# Altium project Mind Cloud Final Project.PrjPcb
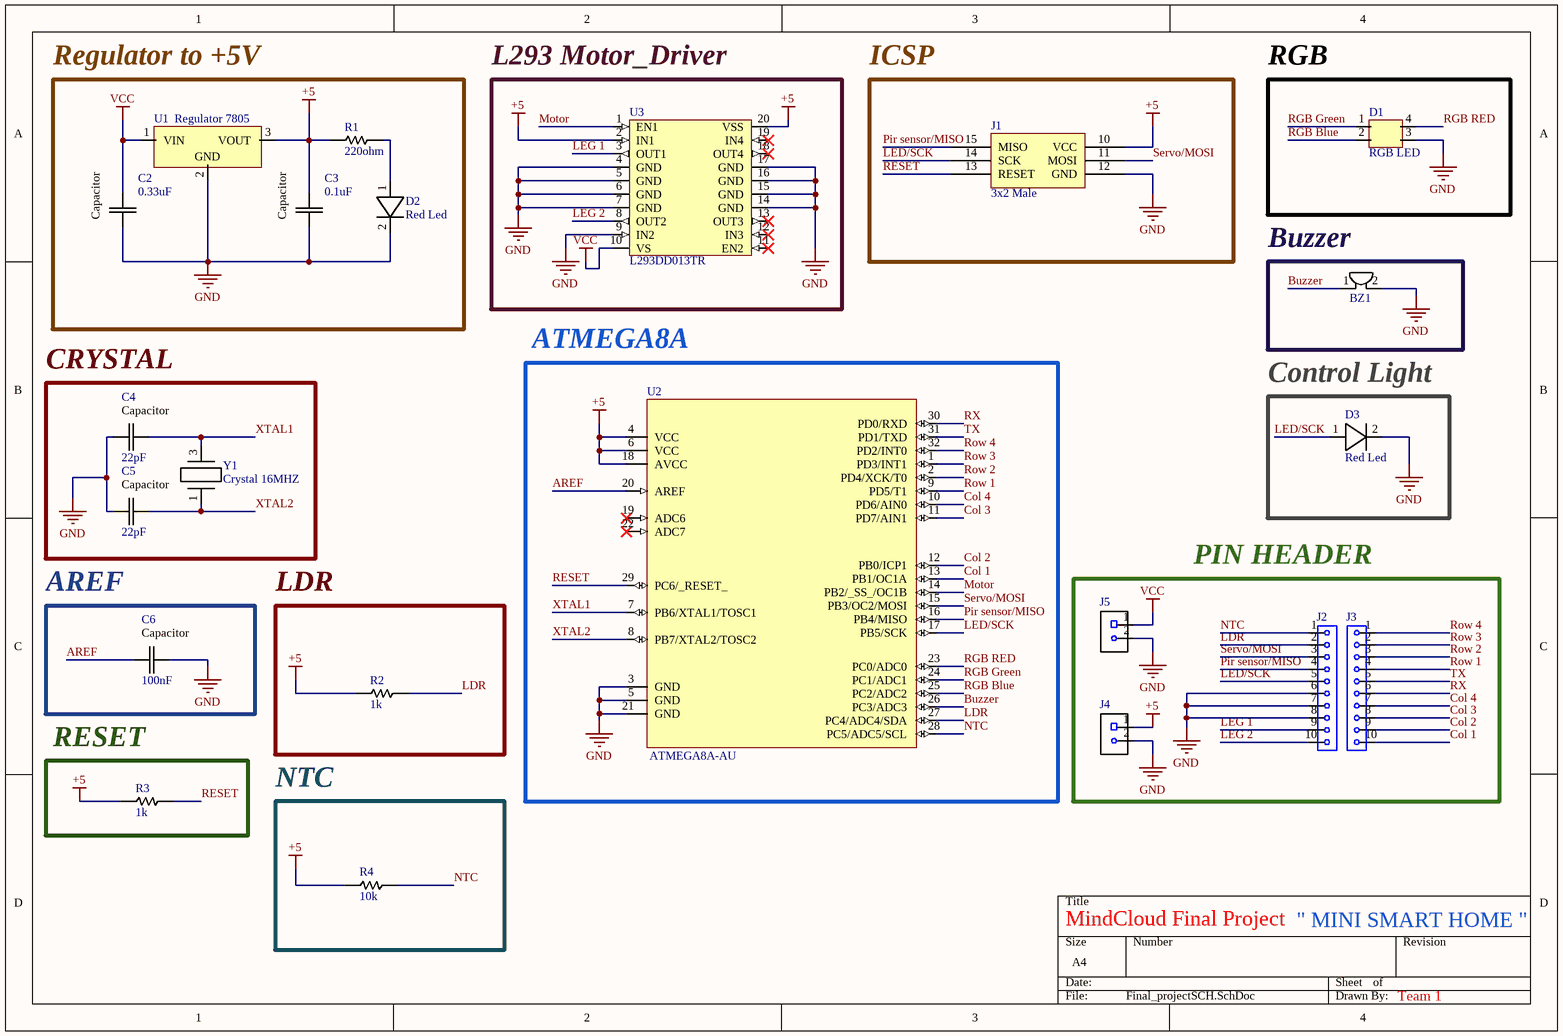
[diagram p0: Final_projectSCH.SchDoc]
Date: 6/9/2024; Team: 1
1 sheet, 22 parts. Net scope: global (net labels, ports and power ports of the same name join across sheets).
Board file: Final_projectPCB.PcbDoc

## Sheet Final_projectSCH.SchDoc
size A4; SheetNumber: 1; SheetTotal: 1

### Parts
BZ1  Buzzer  [Buzzer]  (value not drawn)
C2  0.33uF  [Capacitor SMD]
C3  0.1uF  [Capacitor SMD]
C4  22pF  [Capacitor SMD]
C5  22pF  [Capacitor SMD]
C6  100nF  [Capacitor SMD]
D1  RGB LED  [RGB LED]
D2  Red Led  [Red LED]
D3  Red Led  [Red LED]
J1  3x2 Male  [3x2 Male]
J2  (no value)  [Female Pinheader10]
J3  (no value)  [Female Pinheader10]
J4  Screw Terminal 2 pins  [Screw Terminal 2 pins]  (value not drawn)
J5  Screw Terminal 2 pins  [Screw Terminal 2 pins]  (value not drawn)
R1  220ohm  [R0805]
R2  1k  [R0805]
R3  1k  [R0805]
R4  10k  [R0805]
U1  Regulator 7805  [Regulator 7805]
U2  ATMEGA8A-AU  [ATMEGA8A-AU]
U3  L293DD013TR  [L293DD013TR]
Y1  Crystal 16MHZ  [Crystal 16MHZ]

### Blocks framed on the sheet
Regulator to +5V: C2 C3 D2 R1 U1
L293 Motor_Driver: U3
ICSP: J1
RGB: D1
Buzzer: BZ1
CRYSTAL: C4 C5 Y1
ATMEGA8A: U2
Control Light: D3
AREF: C6
LDR: R2
PIN HEADER: J2-J5
RESET: R3
NTC: R4

### Nets
+5: C3.2 J1.10(VCC) J4.1 R1.2 R2.2 R3.2 R4.2 U1.3(VOUT) U2.4(VCC) U2.6(VCC) U2.18(AVCC) U3.2(IN1) U3.20(VSS)
GND: BZ1.2(-) C2.1 C3.1 C4.1 C5.1 C6.2 D1.3(GND) D2.2(-ve) D3.2(-ve) J1.12(GND) J2.6 J2.7 J2.8 J4.2 J5.2 U1.2(GND) U2.3(GND) U2.5(GND) U2.21(GND) U3.4(GND) U3.5(GND) U3.6(GND) U3.7(GND) U3.9(IN2) U3.14(GND) U3.15(GND) U3.16(GND) U3.17(GND)
VCC: C2.2 J5.1 U1.1(VIN) U3.10(VS)
AREF: C6.1 U2.20(AREF)
Buzzer: BZ1.1(+) U2.26(PC3/ADC3)
Col 1: J3.10 U2.13(PB1/OC1A)
Col 2: J3.9 U2.12(PB0/ICP1)
Col 3: J3.8 U2.11(PD7/AIN1)
Col 4: J3.7 U2.10(PD6/AIN0)
LDR: J2.2 R2.1 U2.27(PC4/ADC4/SDA)
LED/SCK: D3.1(+ve) J1.14(SCK) J2.5 U2.17(PB5/SCK)
LEG 1: J2.9 U3.3(OUT1)
LEG 2: J2.10 U3.8(OUT2)
Motor: U2.14(PB2/_SS_/OC1B) U3.1(EN1)
NTC: J2.1 R4.1 U2.28(PC5/ADC5/SCL)
Pir sensor/MISO: J1.15(MISO) J2.4 U2.16(PB4/MISO)
RESET: J1.13(RESET) R3.1 U2.29(PC6/_RESET_)
RGB Blue: D1.2(DOUT) U2.25(PC2/ADC2)
RGB Green: D1.1(VSS) U2.24(PC1/ADC1)
RGB RED: D1.4(DIN) U2.23(PC0/ADC0)
Row 1: J3.4 U2.9(PD5/T1)
Row 2: J3.3 U2.2(PD4/XCK/T0)
Row 3: J3.2 U2.1(PD3/INT1)
Row 4: J3.1 U2.32(PD2/INT0)
RX: J3.6 U2.30(PD0/RXD)
Servo/MOSI: J1.11(MOSI) J2.3 U2.15(PB3/OC2/MOSI)
TX: J3.5 U2.31(PD1/TXD)
XTAL1: C4.2 U2.7(PB6/XTAL1/TOSC1) Y1.3
XTAL2: C5.2 U2.8(PB7/XTAL2/TOSC2) Y1.1
NetD2_1: D2.1(+ve) R1.1

Not connected (* = marked no-connect by the designer): U2 19(ADC6)* 22(ADC7)*; U3 11(EN2)* 12(IN3)* 13(OUT3)* 18(OUT4)* 19(IN4)*

### Notes on the sheet
- MindCloud Final Project
- " MINI SMART HOME "
- Team 1
- (in symbol Capacitor SMD) Capacitor

### Library data of the parts
BZ1 = Buzzer: Manufacturer: KINGSTATE; Manufacturer Part Number: KXG1205C; Supplier: LCSC; Supplier Part Number: C1122355
C2-C6 = Capacitor SMD: 10V 10uF X7R ±20% 0805 Multilayer Ceramic Capacitors MLCC - SMD/SMT ROHS; Manufacturer: Samwha Capacitor; Manufacturer Part Number: CS2012X7R106M100NRE; Supplier: LCSC; Supplier Part Number: C5189822
D1 = RGB LED: Manufacturer: Worldsemi; Manufacturer Part Number: WS2812B-B/W; Supplier: LSCS ELECTRONICS; Supplier Part Number: C114586
D2 D3 = Red Led: 20mA White Lens 17mcd 639nm Red 170° 1.8V 0603 LED Indication - Discrete ROHS; Manufacturer: Broadcom/AVAGO; Manufacturer Part Number: HSMH-C170; Supplier: LSCS ELECTRONICS; Supplier Part Number: C188731
J1 = M22-5320305R: Headers & Wire Housings 3+3 DIL VRT HDR GOLD 800PC REEL
J2 J3 = Female Pinheader10: Tin 3A Direct Insert 2.54mm -65℃~+125℃ 2.54mm Single Row Black Phosphor Bronze Plugin,P=2.54mm Pin Headers ROHS; Manufacturer: Amphenol ICC; Manufacturer Part Number: 54101-T0600LF; Supplier: LSCS ELECTRONICS; Supplier Part Number: C240305
J4 J5 = Screw Terminal 2 pins: Brass Alloy 1x2P 16A -40℃~+105℃ 300V Blue Tin 12~24 Direct Insert 5.08mm 1 2 Plugin,P=5.08mm Screw Terminal Blocks ROHS; Manufacturer: CUI; Manufacturer Part Number: TB004-508-02BE; Supplier: LSCS ELECTRONICS; Supplier Part Number: C3818636
R1-R4 = Resistor: Carbon Resister 330Ω 250mW ±350ppm/℃ ±5% Plugin,D2.3xL6.5mm Through Hole Resistors ROHS; Manufacturer: CCO(Chian Chia Elec); Manufacturer Part Number: CF1/4W-330Ω±5% T; Supplier: LSCS ELECTRONICS; Supplier Part Number: C120043
U1 = Regulator 7805: 62dB@(120Hz) 1.5A Fixed 5V Positive electrode 35V TO-263-2 Voltage Regulators - Linear, Low Drop Out (LDO) Regulators ROHS; Manufacturer: STMicroelectronics; Manufacturer Part Number: L7805CD2T-TR; Supplier: LSCS ELECTRONICS; Supplier Part Number: C15077
U2 = ATMEGA8A-AU: 8KB 1KB FLASH 23 2.7V~5.5V AVR 16MHz TQFP-32(7x7) Microcontrollers (MCU/MPU/SOC) ROHS; Manufacturer: Microchip Tech; Manufacturer Part Number: ATMEGA8A-AU; Supplier: LSCS ELECTRONICS; Supplier Part Number: C16190
U3 = L293DD013TR: SOIC-20-300mil Stepper Motor Driver ROHS; Manufacturer: STMicroelectronics; Manufacturer Part Number: L293DD013TR; Supplier: LSCS ELECTRONICS; Supplier Part Number: C21610
Y1 = Crystal 16MHZ: 4.5V~5.5V ±50ppm 20mA 16MHz CMOS SMD5032-4P Crystal Oscillators ROHS; Manufacturer: Seiko Epson; Manufacturer Part Number: X1G0044710006; Supplier: LSCS ELECTRONICS; Supplier Part Number: C963334